# EAGLE design Water motor system (EAGLE 9.4.2)
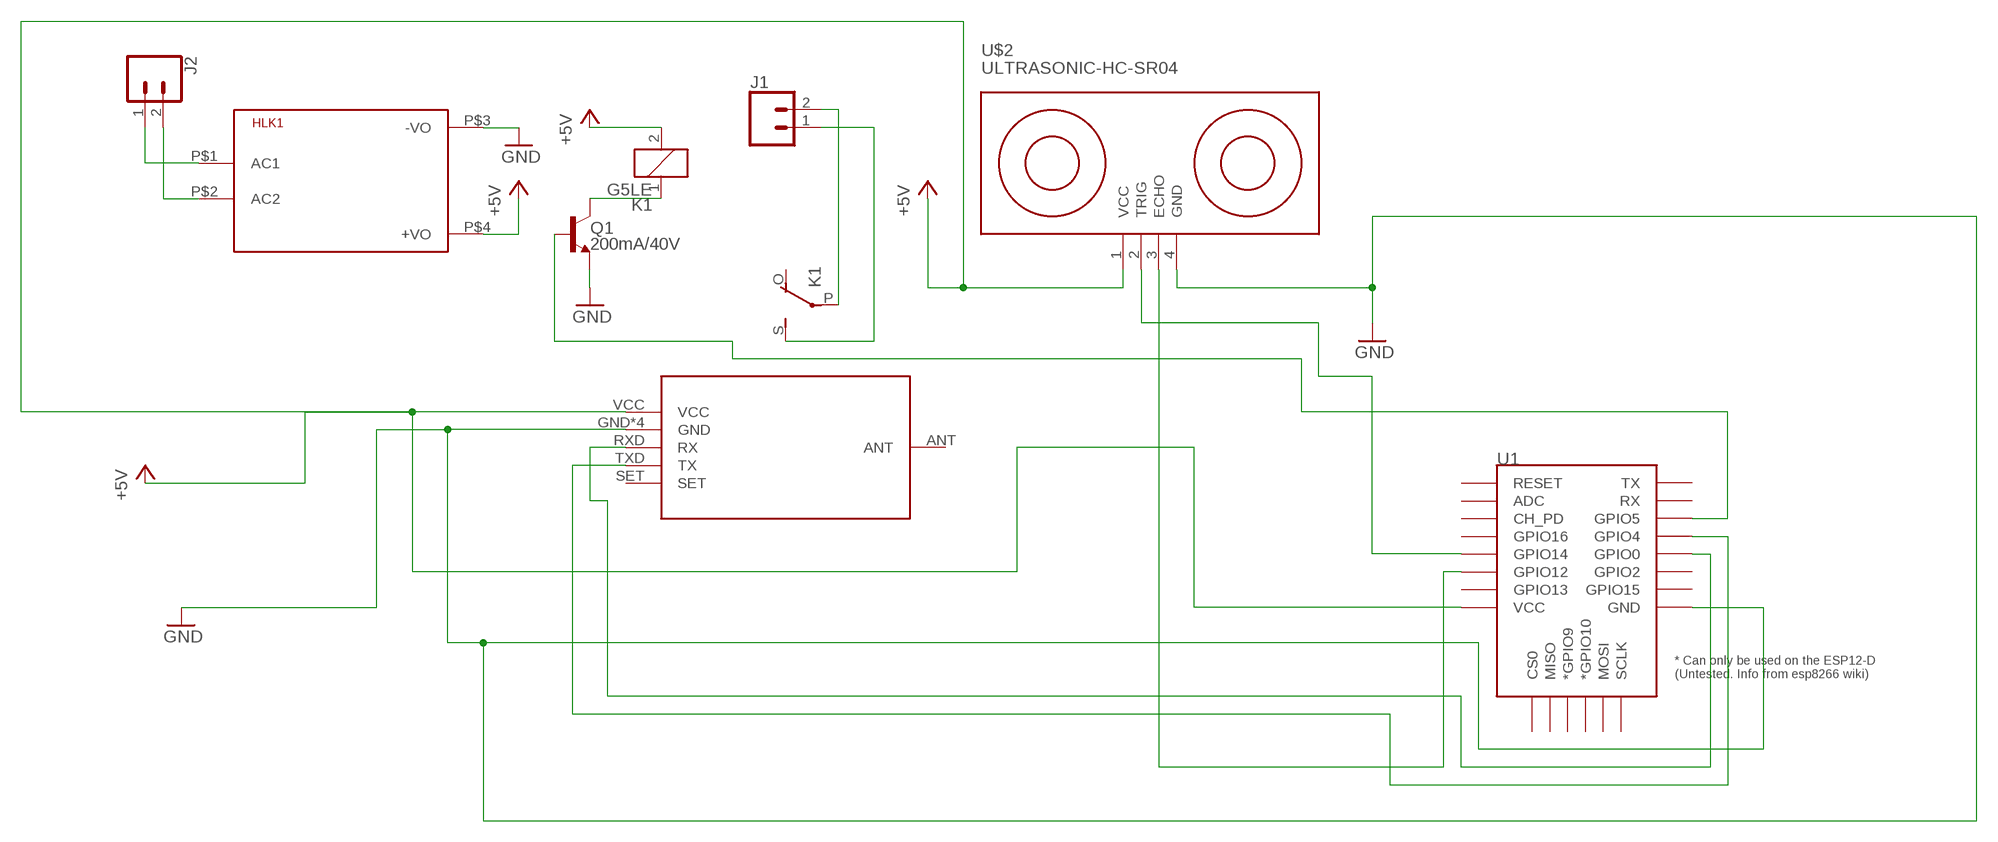
[diagram p0: schematic, sheet 1]

## Parts
HLK1  HLK-PM013W  [HLK-PM01]
J1  CONN_025MM  [SCREWTERMINAL-5MM-2]
J2  CONN_025MM  [SCREWTERMINAL-5MM-2]
K1  G5LE  [G5LE]
Q1  200mA/40V  TRANS_NPN-2N3904  [TO-92]
U1  ESP12ESMD  [ESP12E-SMD]
U$2  ULTRASONIC-HC-SR04  [ULTRASONIC-HC-SR04]
U$3  HC-12_FOOTPRINT  [HC-12_FOOTPRINT]

## Nets
+5V: HLK1.P$4(+VO) K1.2 U1.VCC U$2.1(VCC) U$3.VCC
GND: HLK1.P$3(-VO) Q1.1(E) U1.GND U$2.4(GND) U$3.GND U$3.GND1(GND) U$3.GND2(GND) U$3.MCHFIX(GND)
N$1: U1.GPIO4 U$3.TXD(TX)
N$6: U1.GPIO12 U$2.3(ECHO)
N$7: Q1.2(B) U1.GPIO5
N$8: J1.1 K1.S(2:S)
N$9: J1.2 K1.P(2:P)
N$10: K1.1 Q1.3(C)
N$11: HLK1.P$2(AC2) J2.2
N$12: HLK1.P$1(AC1) J2.1
N$13: U1.GPIO0 U$3.RXD(RX)
N$14: U1.GPIO14 U$2.2(TRIG)
Unconnected: K1.O(2:O) U1.ADC U1.CH_PD U1.CS0 U1.GPIO2 U1.GPIO9(*GPIO9) U1.GPIO10(*GPIO10) U1.GPIO13 U1.GPIO15 U1.GPIO16 U1.MISO U1.MOSI U1.RESET U1.RXD0(RX) U1.SCLK U1.TXD0(TX) U$3.ANT U$3.SET

## Library data of the parts
HLK1 = HLK-PM01:HLK-PM01: Hi-Link Power Supply HLK-PM01 3W Author: Ahmed Said <https://github.com/AhmedSaid/EAGLELibraries>
J1 J2 = SparkFun-Connectors:CONN_02: Multi connection point. Often used as Generic Header-pin footprint for 0.1 inch spaced/style header connections On any of the 0.1 inch spaced packages, you can populate with these: Break Away Headers - Straight <https://www.sparkfun.com/products/116> (PRT-00116) Break Away Male Headers - Right Angle <https://www.sparkfun.com/products/553> (PRT-00553) Female Headers <https://www.sparkfun.com/products/115> (PRT-00115) Break Away Headers - Machine Pin <https://www.sparkfun.com/products/117> (PRT-00117) Break Away Female Headers - Swiss Machine Pin <https://www.sparkfun.com/products/743> (PRT-00743) For SCREWTERMINALS and SPRING TERMINALS visit here: Screw Terimnals on SparkFun.com <https://www.sparkfun.com/search/results?term=Screw+Terminals> (5mm/3.5mm/2.54mm spacing) This device is also useful as a general connection point to wire up your design to another part of your project. Our various solder wires solder well into these plated through hole pads. Hook-Up Wire - Assortment (Stranded, 22 AWG) <https://www.sparkfun.com/products/11375> (PRT-11375) Hook-Up Wire - Assortment (Solid Core, 22 AWG) <https://www.sparkfun.com/products/11367> (PRT-11367) View the entire wire category on our website here <https://www.sparkfun.com/categories/141> Special notes: Molex polarized connector foot print use with: PRT-08233 with associated crimp pins and housings. 2.54_SCREWTERM for use with PRT-10571. 3.5mm Screw Terminal footprints for PRT-08084 5mm Screw Terminal footprints for use with PRT-08432; SF_SKU: PRT-08432
K1 = relay:G5LE: RELAY 1 x switch, 10 A/120 V AC, 8 A/30 V DC, Omron; OC_FARNELL: unknown; OC_NEWARK: unknown
Q1 = SparkFun-DiscreteSemi:TRANS_NPN: NPN transistor Current controlled devices typically used to amplify current or used as a switch. BC547 - COM-08928 <http://www.sparkfun.com/products/8928> (TO-92 45V 100mA) (1.Collector 2.Base 3.Emitter) 2N3904 - COM-00521 <http://www.sparkfun.com/products/521> (TO-92 40V 200mA) (1.Emitter 2.Base 3.Collector) P2N2222A - COM-12852 <http://www.sparkfun.com/products/12852> (TO-92 40V 600mA) (1.Collector 2.Base 3.Emitter); PROD_ID: TRANS-08447
U1 = esp8266modules:ESP12E: ESP12E Module
U$2 = diy-modules:ULTRASONIC-HC-SR04: Ultrasonic Ranging Module HC-SR04 More details available here: http://randomnerdtutorials.com/complete-guide-for-ultrasonic-sensor-hc-sr04/ Click here to find device on ebay.com <http://www.ebay.com/sch/hc+sr04+ultrasonic>
U$3 = hc12_433mhz:HC-12_FOOTPRINT: HC-12 433MHz module footprint MCHFIX is for mechanical fix pin which is NC but on this file connected to GND https://github.com/meendiz/hc-12_si4463/

## Board
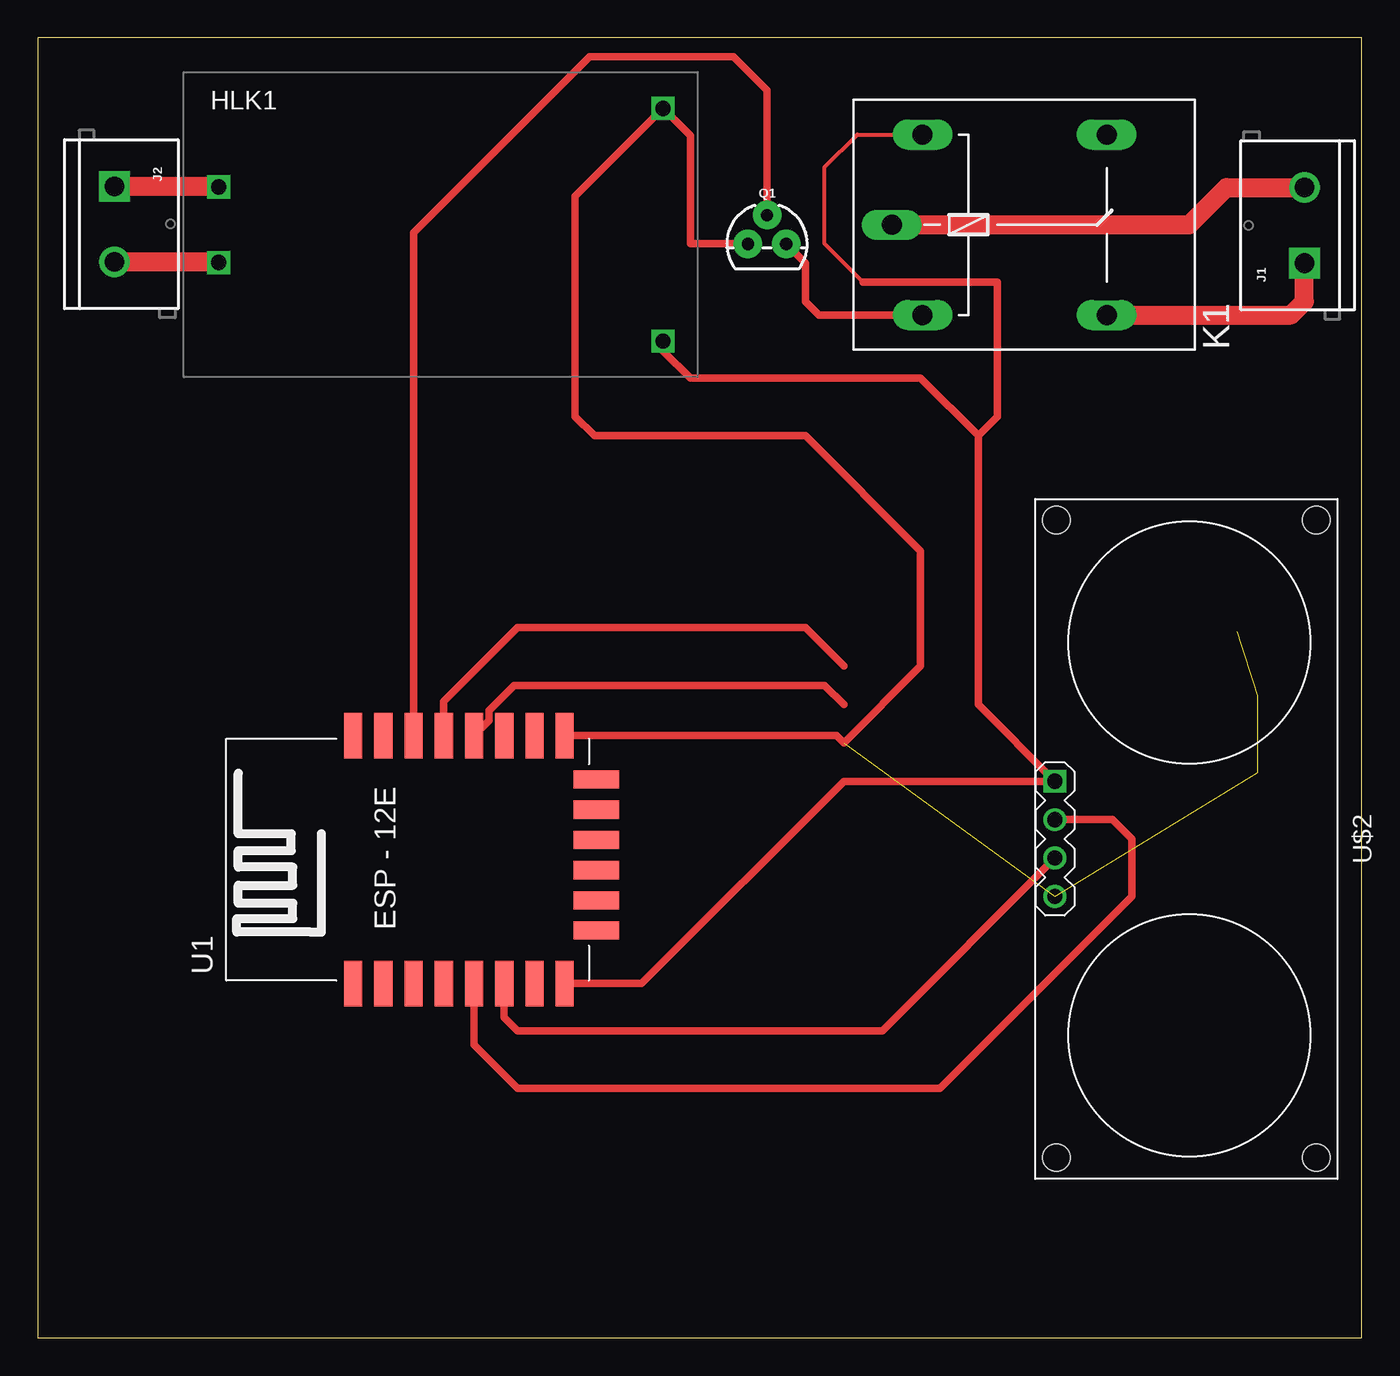
[diagram p1: board, top side]
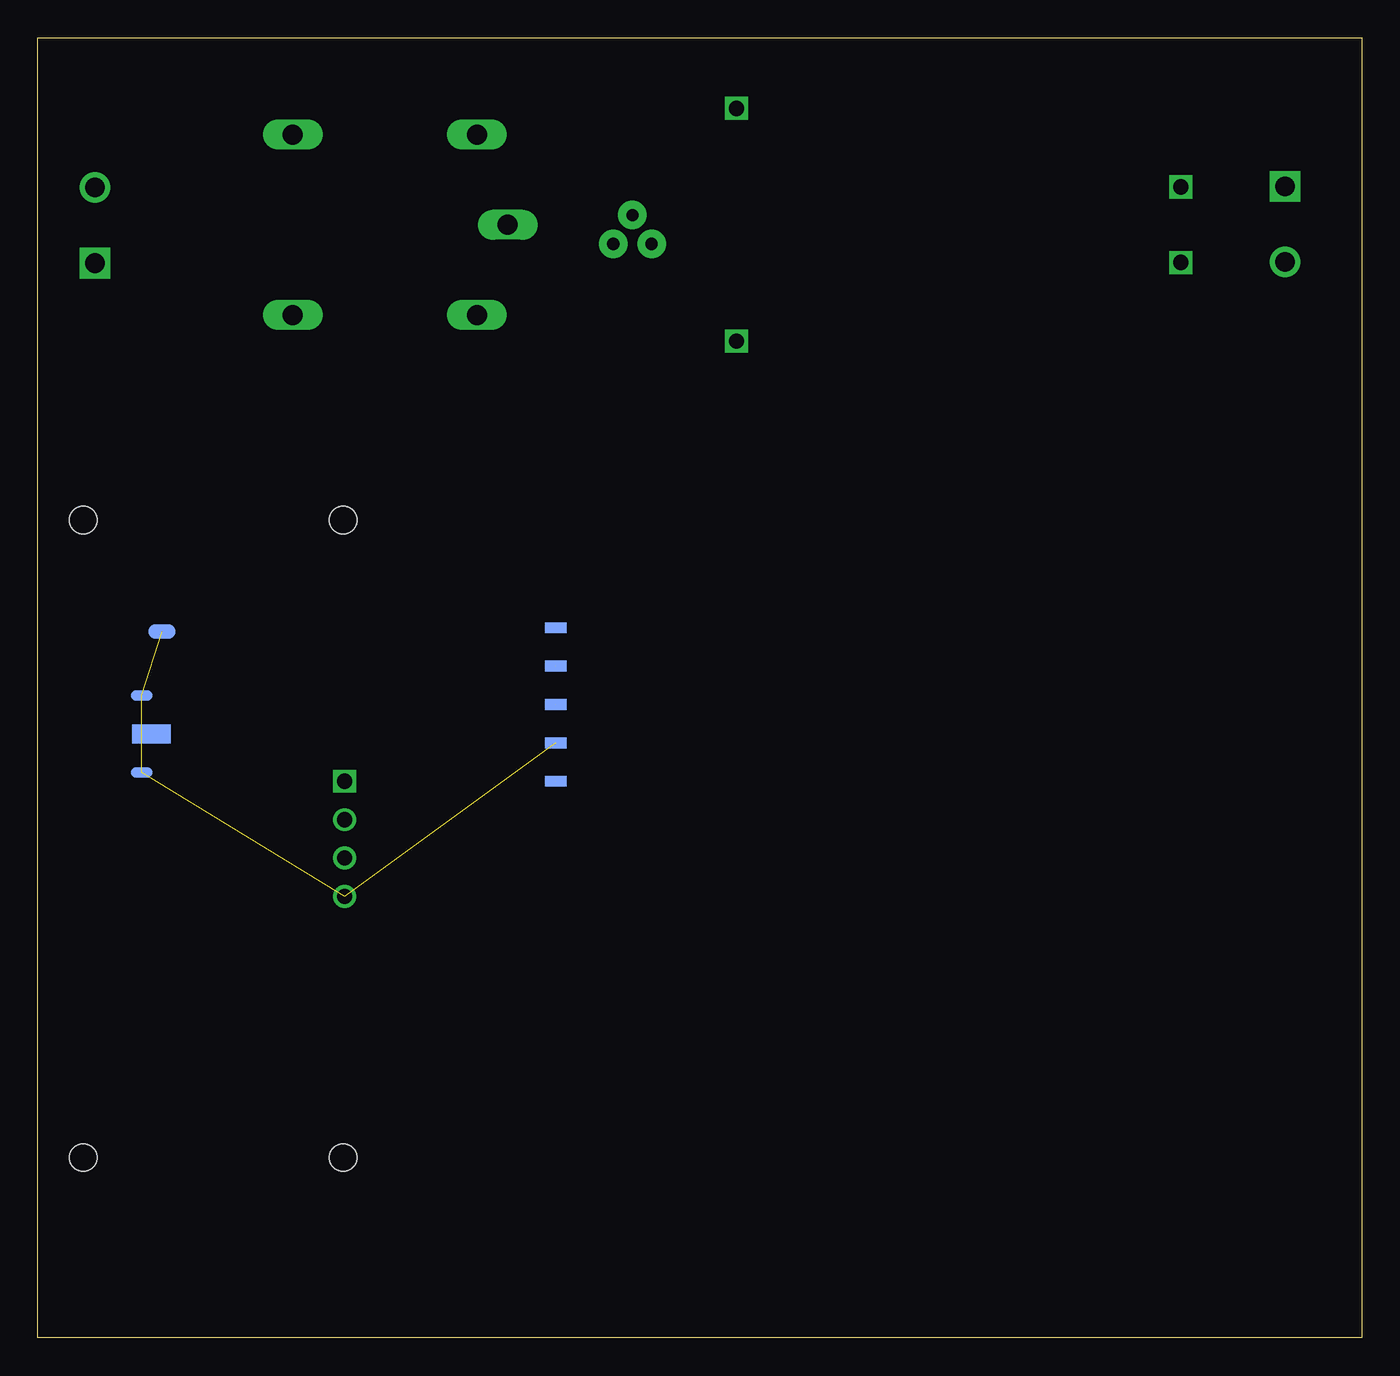
[diagram p2: board, bottom side, seen from below]

Size 87.61 x 86.03 mm. Coordinates in mm from the lower left corner, seen from the top.
Outline: 0,0 87.61,0 87.61,86.03 0,86.03 0,0
Copper layers (1*16): Top 0.035mm / dielectric 1.5mm / Bottom 0.035mm
Design rules "default": minimum track width 6mil, minimum drill 0.35mm, track to track 6mil, track to pad 6mil, pad to pad 6mil, via to via 6mil, smd to smd 6mil, copper to edge 40mil, drill to drill 6mil, minimum pad ring 10mil, minimum via ring 8mil, stop-mask expansion 4mil, vias tented up to drill 0mil, thermal gap 10mil

### Footprints (pad centres in the part's own frame; a part is rotated, then mirrored left to right if it is on the bottom)
HLK-PM01 = drill 1.016 square: P$1 -14.7,2.5; P$2 -14.7,-2.5; P$3 14.7,7.7; P$4 14.7,-7.7
SCREWTERMINAL-5MM-2 = drill 1.3 pad 2.032 square: 1 0,0 | drill 1.3 pad 2.032: 2 5,0
G5LE = drill 1.321 long: 1 -7.493,-5.969; 2 -7.493,5.969; O 4.699,5.969; P -9.525,0; S 4.699,-5.969
TO-92 = drill 0.813 pad 1.88: 1 -1.27,0; 2 0,1.905; 3 1.27,0
ESP12E-SMD = smd 3 x 1.2: ADC -8.3,3.8; CH_PD -8.3,1.8; GND 8.1,-8.2; GPIO0 8.1,-2.2; GPIO2 8.1,-4.2; GPIO4 8.1,-0.2; GPIO5 8.1,1.8; GPIO12 -8.3,-4.2; GPIO13 -8.3,-6.2; GPIO14 -8.3,-2.2; GPIO15 8.1,-6.2; GPIO16 -8.3,-0.2; RESET -8.3,5.8; RXD0 8.1,3.8; TXD0 8.1,5.8; VCC -8.3,-8.2 | smd 1.2 x 3: CS0 -4.8,-10.3; GPIO9 -0.8,-10.3; GPIO10 1.2,-10.3; MISO -2.8,-10.3; MOSI 3.2,-10.3; SCLK 5.2,-10.3
ULTRASONIC-HC-SR04 = drill 1 square: 1 -3.81,-8.89 | drill 1: 2 -1.27,-8.89; 3 1.27,-8.89; 4 3.81,-8.89 | hole 1.8: -21.1,8.4; -21.1,-8.8; 21.1,-8.8; 21.1,8.4
HC-12_FOOTPRINT = smd 2.54 x 1.27: ANT 25.49,7.03 | smd 1.422 x 0.711: GND -1.27,7.62; GND1 26.13,9.57; GND2 26.13,4.49; RXD -1.27,5.08; SET -1.27,0; TXD -1.27,2.54; VCC -1.27,10.16 | smd 1.778 x 0.914: MCHFIX 24.78,0.25

### Placement (x,y rotation side)
HLK1  26.67,73.66 0 top
J1  83.82,71.12 90 top
J2  5.08,76.2 270 top
K1  66.04,73.66 0 top
Q1  48.26,72.39 0 top
U1  26.67,31.75 90 top
U$2  76.2,33.02 270 top
U$3  54.61,46.99 180 bottom

### Tracks (layer width: path | path; a pad name or v marks a point on that pad's centre or on a via)
+5V  (1 unrouted)
  Top 0.254: 54.61,69.85 52.07,72.39 52.07,77.47 54.23,79.63 K1.2
  Top 0.508: 62.23,59.69 62.23,41.91 U$2.1 U$3.VCC 39.96,23.45 U1.VCC | 62.23,59.69 58.42,63.5 43.18,63.5 41.37,65.31 HLK1.P$4 | 54.61,69.85 63.5,69.85 63.5,60.96 62.23,59.69
GND  (5 unrouted)
  Top 0.508: U1.GND 52.86,39.85 U$3.GND 58.42,44.45 58.42,52.07 50.8,59.69 36.83,59.69 35.56,60.96 35.56,75.55 HLK1.P$3 43.18,79.55 43.18,72.39 Q1.1
N$1  (1 unrouted)
  Top 0.508: U1.GPIO4 26.87,42.11 31.75,46.99 50.8,46.99 U$3.TXD
N$6
  Top 0.508: U$2.3 55.88,20.32 31.75,20.32 30.87,21.2 U1.GPIO12
N$7
  Top 0.508: U1.GPIO5 24.87,73.13 36.5,84.76 46.05,84.76 48.26,82.55 Q1.2
N$8
  Top 1.27: K1.S 82.93,67.69 83.82,68.58 J1.1
N$9
  Top 1.27: K1.P 76.2,73.66 78.66,76.12 J1.2
N$10
  Top 0.508: Q1.3 50.8,71.12 50.8,68.58 51.69,67.69 K1.1
N$11
  Top 1.27: J2.2 11.93,71.2 HLK1.P$2
N$12
  Top 1.27: J2.1 11.93,76.2 HLK1.P$1
N$13  (1 unrouted)
  Top 0.508: U1.GPIO0 29.86,40.84 29.86,41.52 31.52,43.18 52.07,43.18 U$3.RXD
N$14
  Top 0.508: U1.GPIO14 28.87,19.39 31.75,16.51 59.69,16.51 72.39,29.21 72.39,33.02 71.12,34.29 U$2.2